# EAGLE design sensor-ctrl (EAGLE 4.16)
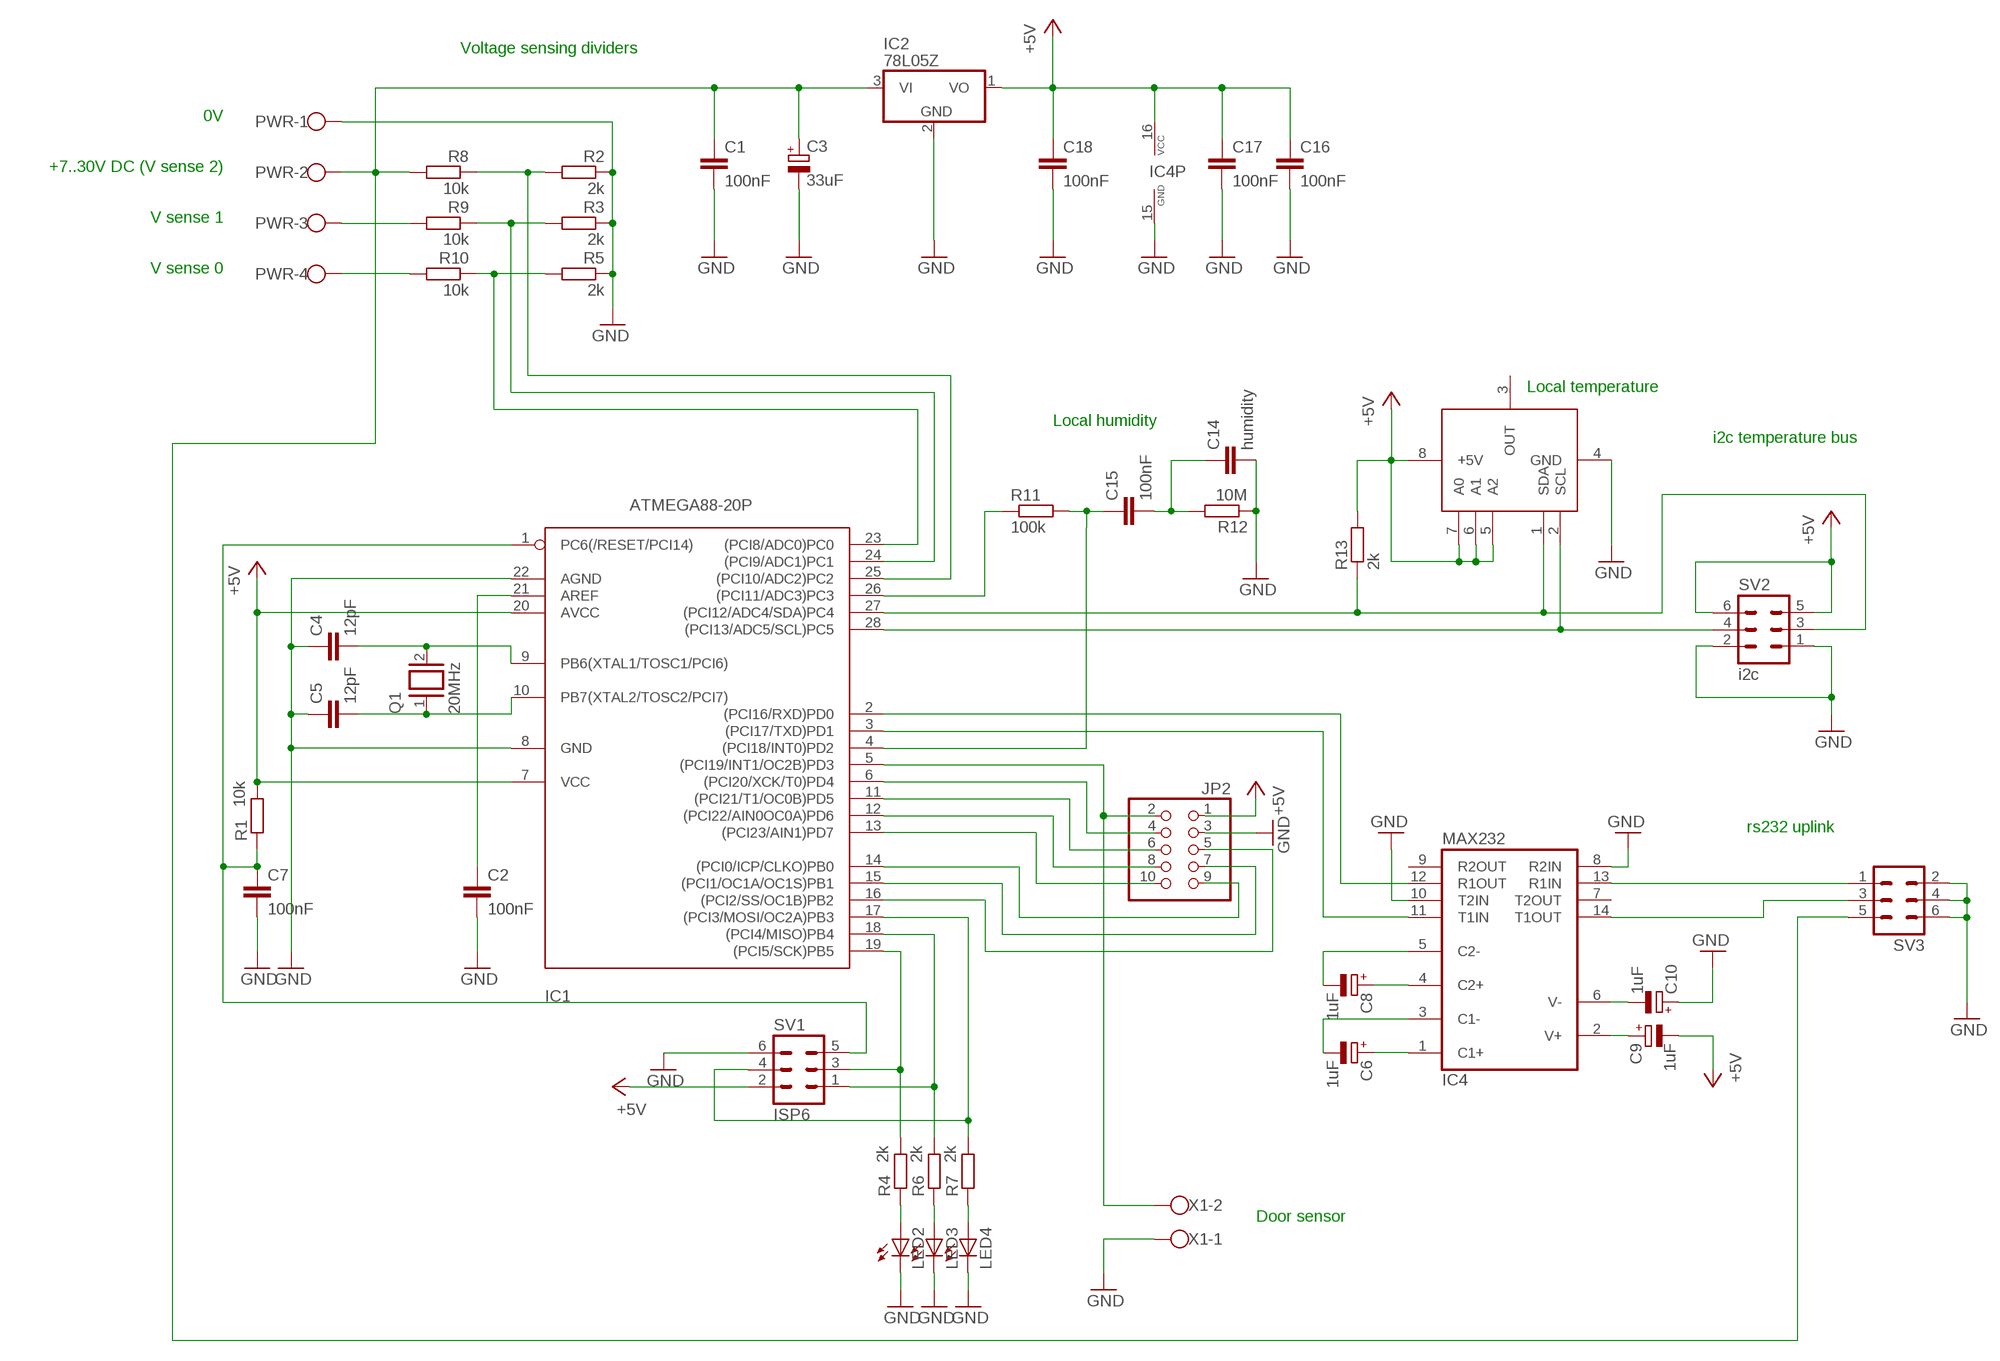
[diagram p0: schematic, sheet 1]

## Parts
C1  100nF  C-EU050-025X075  [C050-025X075]
C2  100nF  C-EU050-025X075  [C050-025X075]
C3  33uF  CPOL-EUE2.5-7  [E2,5-7]
C4  12pF  C-EU025-024X044  [C025-024X044]
C5  12pF  C-EU025-024X044  [C025-024X044]
C6  1uF  CPOL-EUE2,5-6E  [E2,5-6E]
C7  100nF  C-EU050-025X075  [C050-025X075]
C8  1uF  CPOL-EUE2,5-6E  [E2,5-6E]
C9  1uF  CPOL-EUE2,5-6E  [E2,5-6E]
C10  1uF  CPOL-EUE2,5-6E  [E2,5-6E]
C14  humidity  C-EU025-060X050  [C025-060X050]
C15  100nF  C-EU050-025X075  [C050-025X075]
C16  100nF  C-EU050-025X075  [C050-025X075]
C17  100nF  C-EU050-025X075  [C050-025X075]
C18  100nF  C-EU050-025X075  [C050-025X075]
IC1  ATMEGA88-20P  [DIL28-3]
IC2  78L05Z  [TO92]
IC4  MAX232  [DIL16]
JP2  PINHD-2X5  [2X05]
LED2  LED3MM  [LED3MM]
LED3  LED3MM  [LED3MM]
LED4  LED3MM  [LED3MM]
PWR  W237-4  [W237-4]
Q1  20MHz  XTAL/S  [QS]
R1  10k  R-EU_0204/2V  [0204V]
R2  2k  R-EU_0204/2V  [0204V]
R3  2k  R-EU_0204/2V  [0204V]
R4  2k  R-EU_0204/2V  [0204V]
R5  2k  R-EU_0204/2V  [0204V]
R6  2k  R-EU_0204/2V  [0204V]
R7  2k  R-EU_0204/2V  [0204V]
R8  10k  R-EU_0204/2V  [0204V]
R9  10k  R-EU_0204/2V  [0204V]
R10  10k  R-EU_0204/2V  [0204V]
R11  100k  R-EU_0204/2V  [0204V]
R12  10M  R-EU_0204/2V  [0204V]
R13  2k  R-EU_0204/2V  [0204V]
SV1  ISP6  MA03-2  [MA03-2]
SV2  i2c  MA03-2  [MA03-2]
SV3  MA03-2  [MA03-2]
U$5  LM75  [SO8]
X1  W237-102  [W237-102]

## Nets
+5V: C9.- C16.1 C17.1 C18.1 IC1.7(VCC) IC1.20(AVCC) IC2.1(VO) IC4.16(VCC) JP2.1 R1.2 R13.2 SV1.2 SV2.5 SV2.6 U$5.5(A2) U$5.6(A1) U$5.7(A0) U$5.8(+5V)
GND: C1.2 C2.2 C3.- C4.1 C5.1 C7.2 C10.+ C14.2 C16.2 C17.2 C18.2 IC1.8(GND) IC1.22(AGND) IC2.2(GND) IC4.8(R2IN) IC4.10(T2IN) IC4.15(GND) JP2.3 LED2.K(C) LED3.K(C) LED4.K(C) PWR.1 R2.1 R3.1 R5.1 R12.1 SV1.6 SV2.1 SV2.2 SV3.2 SV3.4 SV3.6 U$5.4(GND) X1.1
HMM: IC1.17((PCI3/MOSI/OC2A)PB3) R7.2 SV1.4
N$1: C7.1 IC1.1(PC6(/RESET/PCI14)) R1.1 SV1.5
N$2: IC1.19((PCI5/SCK)PB5) R4.2 SV1.3
N$3: IC1.18((PCI4/MISO)PB4) R6.2 SV1.1
N$4: C5.2 IC1.10(PB7(XTAL2/TOSC2/PCI7)) Q1.1
N$5: IC1.2((PCI16/RXD)PD0) IC4.12(R1OUT)
N$6: IC1.3((PCI17/TXD)PD1) IC4.11(T1IN)
N$7: C4.2 IC1.9(PB6(XTAL1/TOSC1/PCI6)) Q1.2
N$8: IC1.16((PCI2/SS/OC1B)PB2) JP2.5
N$9: IC1.26((PCI11/ADC3)PC3) R11.1
N$10: IC1.15((PCI1/OC1A/OC1S)PB1) JP2.7
N$11: IC1.14((PCI0/ICP/CLKO)PB0) JP2.9
N$12: IC1.13((PCI23/AIN1)PD7) JP2.10
N$13: IC1.12((PCI22/AIN0OC0A)PD6) JP2.8
N$14: IC1.5((PCI19/INT1/OC2B)PD3) JP2.2 X1.2
N$15: C9.+ IC4.2(V+)
N$16: C10.- IC4.6(V-)
N$17: C6.+ IC4.1(C1+)
N$18: IC1.27((PCI12/ADC4/SDA)PC4) R13.1 SV2.3 U$5.1(SDA)
N$19: C6.- IC4.3(C1-)
N$20: C8.- IC4.5(C2-)
N$21: C8.+ IC4.4(C2+)
N$22: C2.1 IC1.21(AREF)
N$23: IC1.6((PCI20/XCK/T0)PD4) JP2.4
N$24: IC1.11((PCI21/T1/OC0B)PD5) JP2.6
N$25: C15.1 IC1.4((PCI18/INT0)PD2) R11.2
N$26: IC1.28((PCI13/ADC5/SCL)PC5) SV2.4 U$5.2(SCL)
N$27: PWR.4 R10.2
N$28: IC1.25((PCI10/ADC2)PC2) R2.2 R8.1
N$29: PWR.3 R9.2
N$30: C14.1 C15.2 R12.2
N$33: IC1.23((PCI8/ADC0)PC0) R5.2 R10.1
N$34: LED2.A R4.1
N$35: LED3.A R6.1
N$36: LED4.A R7.1
N$38: IC4.14(T1OUT) SV3.3
N$65: IC1.24((PCI9/ADC1)PC1) R3.2 R9.1
N$67: C1.1 C3.+ IC2.3(VI) PWR.2 R8.2 SV3.5
RX: IC4.13(R1IN) SV3.1
Unconnected: IC4.7(T2OUT) IC4.9(R2OUT) U$5.3(OUT)

## Notes on the sheet
- Voltage sensing dividers
- 0V
- +7..30V DC (V sense 2)
- V sense 1
- V sense 0
- Local temperature
- Local humidity
- i2c temperature bus
- rs232 uplink
- Door sensor

## Library data of the parts
C1 C2 C4 C5 C7 C14-C18 = rcl:C-EU: CAPACITOR, European symbol
C3 C6 C8-C10 = rcl:CPOL-EU: POLARIZED CAPACITOR, European symbol
IC1 = avr:ATMEGA88*P: MICROCONTROLLER 8 kBytes FLASH 1 kBytes SRAM 512 Bytes EEPROM USART 8-channel 10 bit ADC
IC2 = linear:78*: Positive VOLTAGE REGULATOR
IC4 = maxim:MAX232: RS232 TRANSEIVER
JP2 = pinhead:PINHD-2X5: PIN HEADER
LED2-LED4 = led:LED: LED OSRAM: - CHIPLED LG R971, LG N971, LY N971, LG Q971, LY Q971, LO R971, LY R971 LH N974, LH R974 LS Q976, LO Q976, LY Q976 LO Q996 - Hyper CHIPLED LW Q18S LB Q993, LB Q99A, LB R99A - SideLED LS A670, LO A670, LY A670, LG A670, LP A670 LB A673, LV A673, LT A673, LW A673 LH A674 LY A675 LS A676, LA A676, LO A676, LY A676, LW A676 LS A679, LY A679, LG A679 - Hyper Micro SIDELED® LS Y876, LA Y876, LO Y876, LY Y876 LT Y87S - SmartLED LW L88C, LW L88S LB L89C, LB L89S, LG L890 LS L89K, LO L89K, LY L89K LS L896, LA L896, LO L896, LY L896 - TOPLED LS T670, LO T670, LY T670, LG T670, LP T670 LSG T670, LSP T670, LSY T670, LOP T670, LYG T670 LG T671, LOG T671, LSG T671 LB T673, LV T673, LT T673, LW T673 LH T674 LS T676, LA T676, LO T676, LY T676, LB T676, LH T676, LSB T676, LW T676 LB T67C, LV T67C, LT T67C, LS T67K, LO T67K, LY T67K, LW E67C LS E67B, LA E67B, LO E67B, LY E67B, LB E67C, LV E67C, LT E67C LW T67C LS T679, LY T679, LG T679 LS T770, LO T770, LY T770, LG T770, LP T770 LB T773, LV T773, LT T773, LW T773 LH T774 LS E675, LA E675, LY E675, LS T675 LS T776, LA T776, LO T776, LY T776, LB T776 LHGB T686 LT T68C, LB T68C - Hyper Mini TOPLED® LB M676 - Mini TOPLED Santana® LG M470 LS M47K, LO M47K, LY M47K Source: http://www.osram.convergy.de/
PWR = con-wago-500:W237-4: WAGO SCREW CLAMP
Q1 = special:XTAL/S: CRYSTAL
R1-R13 = rcl:R-EU_: RESISTOR, European symbol
SV1-SV3 = con-lstb:MA03-2: PIN HEADER
U$5 = lm75:LM75
X1 = con-wago-500:W237-102: WAGO SCREW CLAMP

## Board
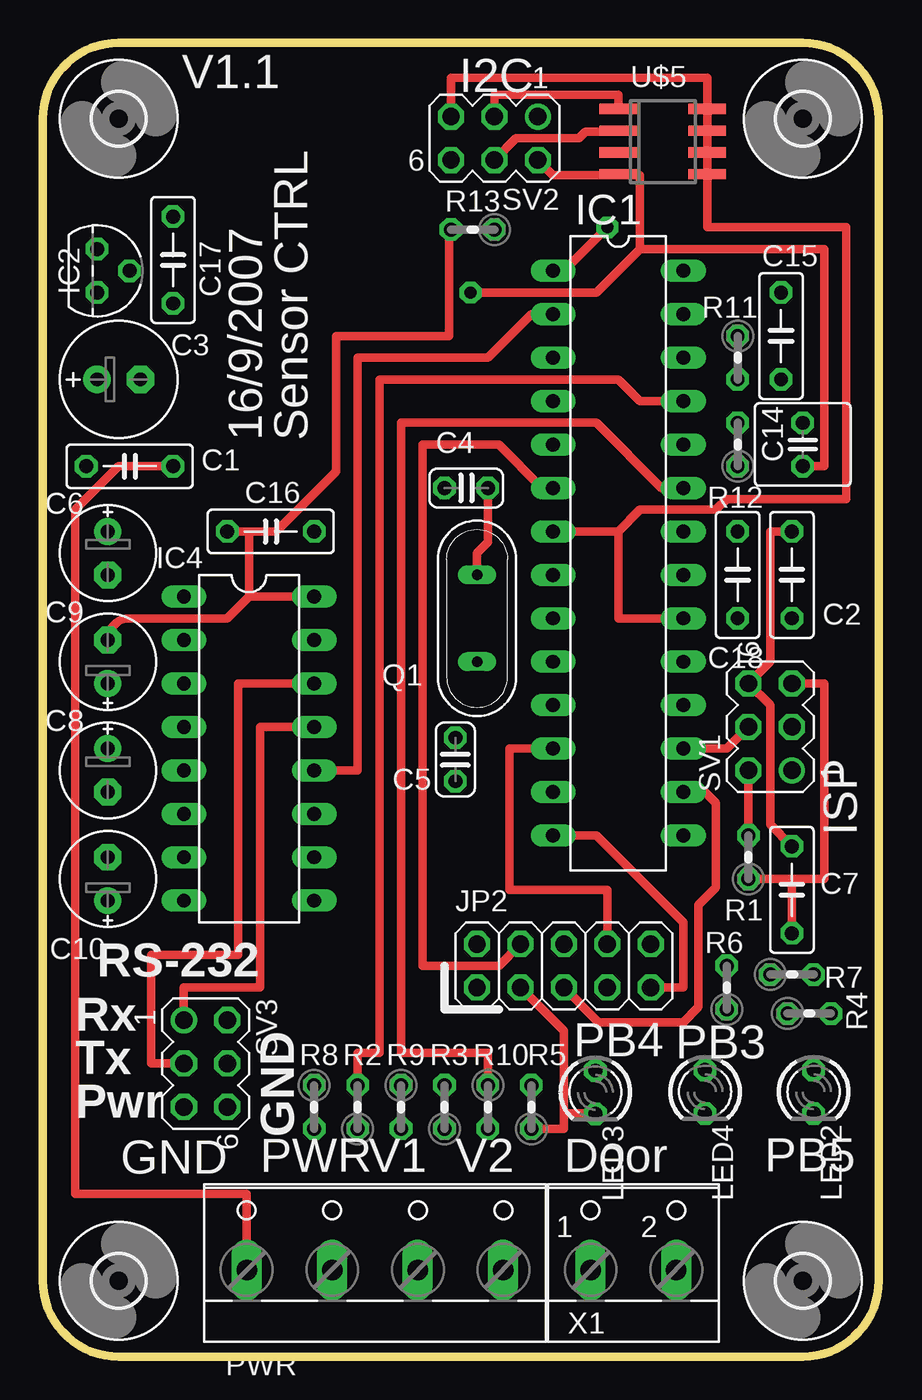
[diagram p1: board, top side]
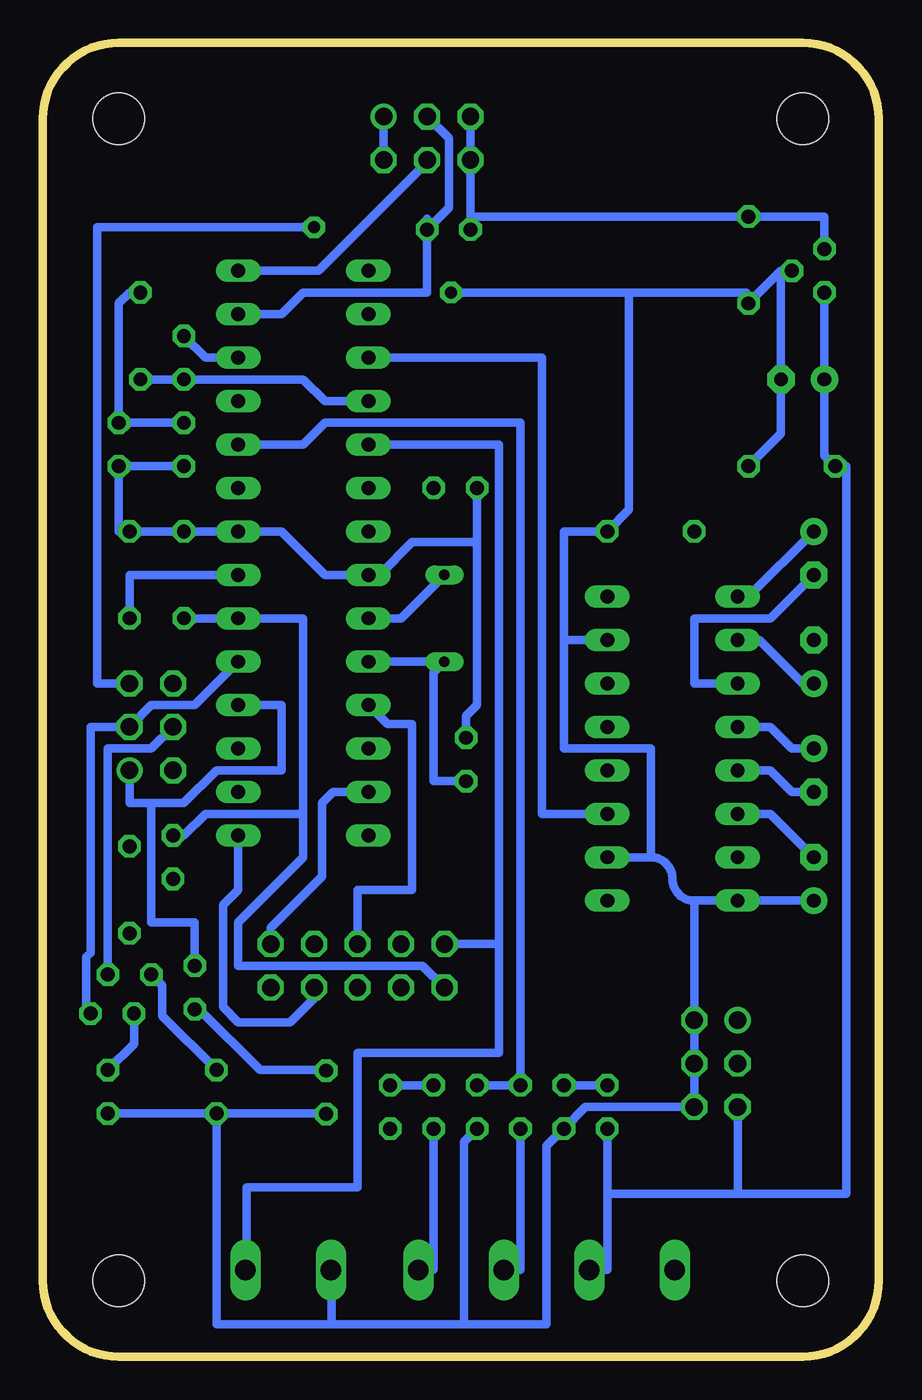
[diagram p2: board, bottom side, seen from below]

Size 48.9 x 76.83 mm. Coordinates in mm from the lower left corner, seen from the top.
Outline: 0,72.39 arc-90 4.45,76.83 44.45,76.83 arc-90 48.9,72.39 48.9,4.45 arc-90 44.45,0 4.45,0 arc-90 0,4.45 0,72.39
Copper layers (1*16): Top 0.035mm / dielectric 1.5mm / Bottom 0.035mm
Design rules "default": minimum track width 10mil, minimum drill 24mil, track to track 8mil, track to pad 8mil, pad to pad 8mil, via to via 8mil, smd to smd 8mil, copper to edge 40mil, drill to drill 8mil, minimum pad ring 10mil, minimum via ring 8mil, stop-mask expansion 4mil, vias tented up to drill 0mil, thermal gap 10mil

### Footprints (pad centres in the part's own frame; a part is rotated, then mirrored left to right if it is on the bottom)
C050-025X075 = drill 0.813 octagon: 1 -2.54,0; 2 2.54,0
E2,5-7 = drill 0.813 pad 1.6 round: + -1.27,0 | drill 0.813 pad 1.6 octagon: - 1.27,0
C025-024X044 = drill 0.813 octagon: 1 -1.27,0; 2 1.27,0
E2,5-6E = drill 0.813 pad 1.575 round: + -1.27,0 | drill 0.813 pad 1.575 octagon: - 1.27,0
C025-060X050 = drill 0.813 octagon: 1 -1.27,0; 2 1.27,0
DIL28-3 = drill 0.813 long: 1 -16.51,-3.81; 2 -13.97,-3.81; 3 -11.43,-3.81; 4 -8.89,-3.81; 5 -6.35,-3.81; 6 -3.81,-3.81; 7 -1.27,-3.81; 8 1.27,-3.81; 9 3.81,-3.81; 10 6.35,-3.81; 11 8.89,-3.81; 12 11.43,-3.81; 13 13.97,-3.81; 14 16.51,-3.81; 15 16.51,3.81; 16 13.97,3.81; 17 11.43,3.81; 18 8.89,3.81; 19 6.35,3.81; 20 3.81,3.81; 21 1.27,3.81; 22 -1.27,3.81; 23 -3.81,3.81; 24 -6.35,3.81; 25 -8.89,3.81; 26 -11.43,3.81; 27 -13.97,3.81; 28 -16.51,3.81
TO92 = drill 0.813 octagon: 1 -1.27,0; 2 0,1.905; 3 1.27,0
DIL16 = drill 0.813 long: 1 -8.89,-3.81; 2 -6.35,-3.81; 3 -3.81,-3.81; 4 -1.27,-3.81; 5 1.27,-3.81; 6 3.81,-3.81; 7 6.35,-3.81; 8 8.89,-3.81; 9 8.89,3.81; 10 6.35,3.81; 11 3.81,3.81; 12 1.27,3.81; 13 -1.27,3.81; 14 -3.81,3.81; 15 -6.35,3.81; 16 -8.89,3.81
2X05 = drill 1.016 octagon: 1 -5.08,-1.27; 2 -5.08,1.27; 3 -2.54,-1.27; 4 -2.54,1.27; 5 0,-1.27; 6 0,1.27; 7 2.54,-1.27; 8 2.54,1.27; 9 5.08,-1.27; 10 5.08,1.27
LED3MM = drill 0.813 octagon: A -1.27,0; K 1.27,0
W237-4 = drill 1.194 long: 1 -7.5,-1.27; 2 -2.5,-1.27; 3 2.5,-1.27; 4 7.5,-1.27
QS = drill 0.61 long: 1 -2.54,0; 2 2.54,0
0204V = drill 0.813 octagon: 1 -1.27,0; 2 1.27,0
MA03-2 = drill 1.016 round: 1 -2.54,-1.27 | drill 1.016 octagon: 2 -2.54,1.27; 3 0,-1.27; 4 0,1.27; 5 2.54,-1.27; 6 2.54,1.27
3,0 = hole 3: 0,0
SO8 = smd 0.6 x 2.2: 1 -1.905,-2.6; 2 -0.635,-2.6; 3 0.635,-2.6; 4 1.905,-2.6; 5 1.905,2.6; 6 0.635,2.6; 7 -0.635,2.6; 8 -1.905,2.6
W237-102 = drill 1.194 long: 1 -2.5,-1.27; 2 2.5,-1.27

### Placement (x,y rotation side)
C1  5.08,52.07 0 top
C2  43.82,45.72 90 top
C3  4.45,57.15 0 top
C4  24.76,50.8 0 top
C5  24.13,34.93 270 top
C6  3.81,46.99 270 top
C7  43.82,27.3 90 top
C8  3.81,34.29 270 top
C9  3.81,40.64 90 top
C10  3.81,27.94 90 top
C14  44.45,53.34 270 top
C15  43.18,59.69 90 top
C16  13.34,48.26 0 top
C17  7.62,64.13 270 top
C18  40.64,45.72 90 top
IC1  33.66,46.99 270 top
IC2  3.17,63.5 270 top
IC4  12.06,35.56 270 top
JP2  30.48,22.86 0 top
LED2  45.09,15.49 270 top
LED3  32.32,15.46 270 top
LED4  38.73,15.49 270 top
PWR  19.43,6.35 0 top
Q1  25.4,43.18 90 top
R1  41.27,29.21 90 top
R2  18.41,14.61 90 top
R3  23.49,14.61 90 top
R4  44.83,20.07 0 top
R5  28.57,14.61 90 top
R6  40.01,21.59 90 top
R7  43.82,22.35 0 top
R8  15.88,14.61 270 top
R9  20.95,14.61 270 top
R10  26.04,14.61 270 top
R11  40.64,58.42 270 top
R12  40.64,53.34 90 top
R13  25.15,65.91 180 top
SV1  42.55,36.83 90 top
SV2  26.42,71.25 180 top
SV3  9.53,17.14 270 top
U$1  [3,0]  4.45,4.45 0 top
U$2  [3,0]  4.45,72.39 0 top
U$3  [3,0]  44.45,72.39 0 top
U$4  [3,0]  44.45,4.45 0 top
U$5  36.26,71.06 270 top
X1  34.54,6.35 0 top

### Tracks (layer width: path | path; a pad name or v marks a point on that pad's centre or on a via)
+5V
  Top 0.5: C9.- arc-90 5.08,43.18 10.79,43.18 12.06,44.45 | 12.06,44.45 IC4.16 | 33.66,48.26 IC1.7 | 33.66,48.26 33.66,43.18 IC1.20 | R1.2 SV1.2 | 33.66,48.26 34.93,49.53 39.37,49.53 40.01,50.16 46.99,50.16 46.99,66.04 38.86,66.04 U$5.5 U$5.6 | 12.06,44.45 12.06,48.26 | 12.06,48.26 C16.1 | 12.06,48.26 13.65,48.26 17.14,51.75 17.14,59.69 23.75,59.69 23.75,65.91 R13.2 | U$5.7 38.86,71.63 | U$5.7 U$5.8 38.86,74.8 23.88,74.8 SV2.5 | U$5.6 38.86,70.36 | U$5.7 | U$5.7 U$5.6 | U$5.6
  Bottom 0.5: IC2.1 3.17,66.67 C17.1 23.88,66.67 | 33.66,31.75 33.66,43.18 IC1.20 C18.1 | 33.66,31.75 33.66,29.21 37.47,25.4 37.47,22.86 26.67,22.86 JP2.1 | 33.66,31.75 39.37,31.75 40.64,30.48 R1.2 | IC1.7 28.96,48.26 | SV2.6 23.88,69.85 | SV2.6 SV2.5 | R13.2 23.88,66.67 | 23.88,66.67 SV2.6
GND  (via drill 0.7 pad 1.27)
  Top 0.5: C14.2 45.72,52.07 45.72,64.77 34.93,64.77 | 34.93,64.77 32.39,62.23 v25.02,62.23 | JP2.3 30.48,19.05 30.48,14.22 | 30.48,14.22 30.48,13.34 R5.1 | C2.2 42.55,48.26 42.55,40.64 SV1.6 42.55,38.1 42.55,31.12 C7.2 | C1.2 4.45,52.07 1.91,49.53 1.91,9.52 11.94,9.52 PWR.1 | 32.35,14.22 32.39,14.22 | LED3.K 32.35,14.22 | 32.35,14.22 30.48,14.22 | SV2.2 29.84,69.09 33.59,69.09 U$5.4 33.66,69.09 34.93,69.09 34.93,64.77
  Bottom 0.5: C10.+ IC4.8 10.79,26.67 | 10.79,26.67 arc90 12.06,27.94 arc-90 13.34,29.21 | 13.34,29.21 IC4.10 | 18.41,41.91 IC4.15 | 18.41,41.91 18.41,35.56 13.34,35.56 13.34,29.21 | R12.1 C14.2 44.45,48.26 C2.2 C18.2 IC1.22 34.93,48.26 32.39,45.72 IC1.8 29.21,45.72 27.3,47.62 23.49,47.62 | X1.1 32,5.08 32,1.91 | 24.26,1.91 19.43,1.91 19.43,12.32 R2.1 17.14,14.61 SV3.6 SV3.4 SV3.2 10.79,26.67 | 24.26,1.91 32,1.91 | 23.49,47.62 C4.1 | 32,1.91 38.73,1.91 LED4.K | C5.1 24.13,37.47 23.49,38.1 23.49,47.62 | C1.2 5.71,53.98 C3.- 5.71,63.5 | 5.71,63.5 IC2.2 | 5.71,63.5 C17.2 7.75,61.72 7.75,62.23 14.61,62.23 | 18.41,41.91 18.41,48.26 C16.2 14.61,49.53 14.61,62.23 | 14.61,62.23 v25.02,62.23 | LED3.K 32.29,14.19 32.26,14.22 LED4.K | LED4.K LED2.K | R3.1 24.26,12.57 24.26,1.91 | SV2.2 SV2.1
HMM
  Top 0.5: SV1.4 40.01,35.56 IC1.17
  Bottom 0.5: SV1.4 42.55,35.56 45.09,35.56 R7.2
N$1  (via drill 0.7 pad 1.27)
  Top 0.5: IC1.1 30.48,63.5 v33.02,66.04 | SV1.5 45.72,39.37 45.72,27.94 43.82,27.94 | 43.82,27.94 R1.1 | C7.1 43.82,27.94
  Bottom 0.5: v33.02,66.04 45.72,66.04 45.72,39.37 SV1.5
N$2
  Bottom 0.5: IC1.19 40.01,38.1 42.55,38.1 SV1.3 46.1,36.83 46.1,23.62 46.36,23.37 46.36,20.45 R4.2
N$3
  Bottom 0.5: IC1.18 34.93,38.1 34.93,34.29 38.73,34.29 40.64,32.38 42.55,32.38 | SV1.1 43.82,32.38 42.55,32.38 | R6.2 40.01,25.4 42.55,25.4 42.55,32.38
N$4
  Bottom 0.5: IC1.10 Q1.1 26.04,40.01 26.04,33.66 C5.2
N$5
  Top 0.5: IC4.12 18.41,34.29 18.41,58.42 26.04,58.42 28.57,60.96 IC1.2
N$6
  Bottom 0.5: IC1.3 19.68,58.42 19.68,31.75 IC4.11
N$7
  Top 0.5: C4.2 26.04,47.62 25.4,46.99 Q1.2
  Bottom 0.5: 28.57,43.18 IC1.9 27.94,43.18 Q1.2
N$8
  Top 0.5: IC1.16 38.73,33.02 39.37,32.38 39.37,27.43 38.35,26.42 38.35,20.45 37.47,19.56 32.51,19.56 JP2.5
N$9
  Bottom 0.5: IC1.26 39.37,58.42 R11.1
N$10
  Bottom 0.5: IC1.15 37.47,27.3 38.35,26.42 38.35,20.45 37.47,19.56 34.42,19.56 33.02,20.96 JP2.7
N$11
  Top 0.5: JP2.9 37.47,21.59 37.47,25.4 32.39,30.48 IC1.14
N$12
  Bottom 0.5: IC1.13 31.91,33.02 32.54,32.38 32.54,28.1 35.56,25.08 JP2.10 35.56,23.97
N$13
  Top 0.5: JP2.8 33.02,27.3 27.3,27.3 27.3,35.56 IC1.12
N$14
  Bottom 0.5: IC1.5 22.22,53.34 22.22,24.13 | 22.22,24.13 22.22,17.78 30.48,17.78 30.48,9.91 36.96,9.91 36.96,5.08 X1.2 | 22.22,24.13 JP2.2
N$15
  Bottom 0.5: C9.+ 4.45,39.37 6.99,41.91 IC4.2
N$16
  Bottom 0.5: C10.- 6.35,31.75 IC4.6
N$17
  Bottom 0.5: C6.+ 7.62,44.45 IC4.1
N$18
  Top 0.5: U$5.1 | U$5.1 33.66,72.9 | U$5.1 33.66,73.79 26.42,73.79 SV2.3 26.42,72.39
  Bottom 0.5: IC1.27 34.93,60.96 33.66,62.23 26.42,62.23 26.42,66.04 | SV2.3 25.15,71.25 25.15,67.18 R13.1 26.42,66.04 | 26.42,66.04 26.42,66.55
N$19
  Bottom 0.5: C6.- 6.35,43.18 10.79,43.18 10.79,39.37 IC4.3
N$20
  Bottom 0.5: C8.- 5.08,33.02 6.35,34.29 IC4.5
N$21
  Bottom 0.5: C8.+ 5.08,35.56 6.35,36.83 IC4.4
N$22
  Bottom 0.5: IC1.21 43.82,45.72 C2.1
N$23
  Top 0.5: IC1.6 29.21,50.8 26.67,53.34 22.22,53.34 22.22,22.86 26.67,22.86 JP2.4
N$24
  Bottom 0.5: IC1.11 28.73,36.99 27.3,36.99 27.3,27.3 30.48,27.3 JP2.6
N$25
  Bottom 0.5: IC1.4 32.39,55.88 33.66,57.15 R11.2 C15.1
N$26
  Top 0.5: 33.59,71.75 U$5.2 33.66,71.63 31.75,71.63 31.37,71.25 27.69,71.25 SV2.4
  Bottom 0.5: IC1.28 32.77,63.5 26.42,69.85 SV2.4
N$27
  Bottom 0.5: PWR.4 26.04,5.08 R10.2
N$28
  Top 0.5: IC1.25 34.93,55.88 33.66,57.15 19.68,57.15 19.68,17.78 18.41,17.78 R2.2
  Bottom 0.5: R8.1 R2.2
N$29
  Bottom 0.5: PWR.3 20.95,5.08 R9.2
N$30
  Bottom 0.5: R12.2 C14.1 44.45,61.6 43.82,62.23 C15.2
N$33
  Top 0.5: IC1.23 36.2,50.8 32.39,54.61 20.95,54.61 20.95,17.78 26.04,17.78 R10.1
  Bottom 0.5: R10.1 R5.2
N$34
  Bottom 0.5: R4.1 43.56,18.29 LED2.A
N$35
  Bottom 0.5: R6.1 39.75,20.32 36.2,16.76 32.26,16.76 32.29,16.73 LED3.A
N$36
  Bottom 0.5: LED4.A 41.91,19.94 41.91,21.72 R7.1
N$38
  Top 0.5: IC4.14 11.43,39.37 11.43,23.5 6.35,23.5 6.35,17.14 SV3.3
N$65
  Bottom 0.5: R3.2 R9.1 20.95,54.61 32.39,54.61 33.66,53.34 IC1.24
N$67
  Bottom 0.5: PWR.2 15.88,5.08 15.88,9.52 | 8.26,9.52 1.91,9.52 1.91,52.07 C1.1 3.17,52.7 C3.+ IC2.3 | 8.26,9.52 15.88,9.52 | 15.88,9.52 R8.2 | 8.26,9.52 SV3.5
RX
  Top 0.5: IC4.13 12.7,36.83 12.7,21.59 8.26,21.59 SV3.1

### Text on the board
tPlace: I2C | V1.1 | 16/9/2007 | Sensor CTRL | ISP | RS-232 | Rx | GND | PB4 | PB3 | Tx | Pwr | GND | PB5 | PWR | V1 | V2 | Door
_tsilk: I2C | Sensor CTRL | V1.0 | 12/8/2007 | LM75 | 78L05Z | IC1 | C15 | IC2 | C17 | ATMEGA88-20P | 100k | R11 | 33uF | C3 | 10M | C4 | C14 | C1 | humidity | C6 | 12pF | R12 | C16 | C2 | 1uF | IC4 | C9 | MAX232 | 20MHz | C18 | Q1 | C8 | 12pF | C5 | ISP | 10k | C7 | JP2 | R1 | C10 | RS-232 | Rx | GND | PB4 | PB3 | PB5 | 10k | 2k | 10k | 2k | 10k | 2k | R8 | R2 | R9 | R3 | R10 | R5 | 330 | Tx | Pwr | GND | PWR | V1 | V2 | Door | R6 | R7 | R4 | 1 | 2